# Altium schematic sheet LEDcontroller.SchDoc
size A3; Author: MAKinteract; Revision: 1; SheetNumber: 2; SheetTotal: 3
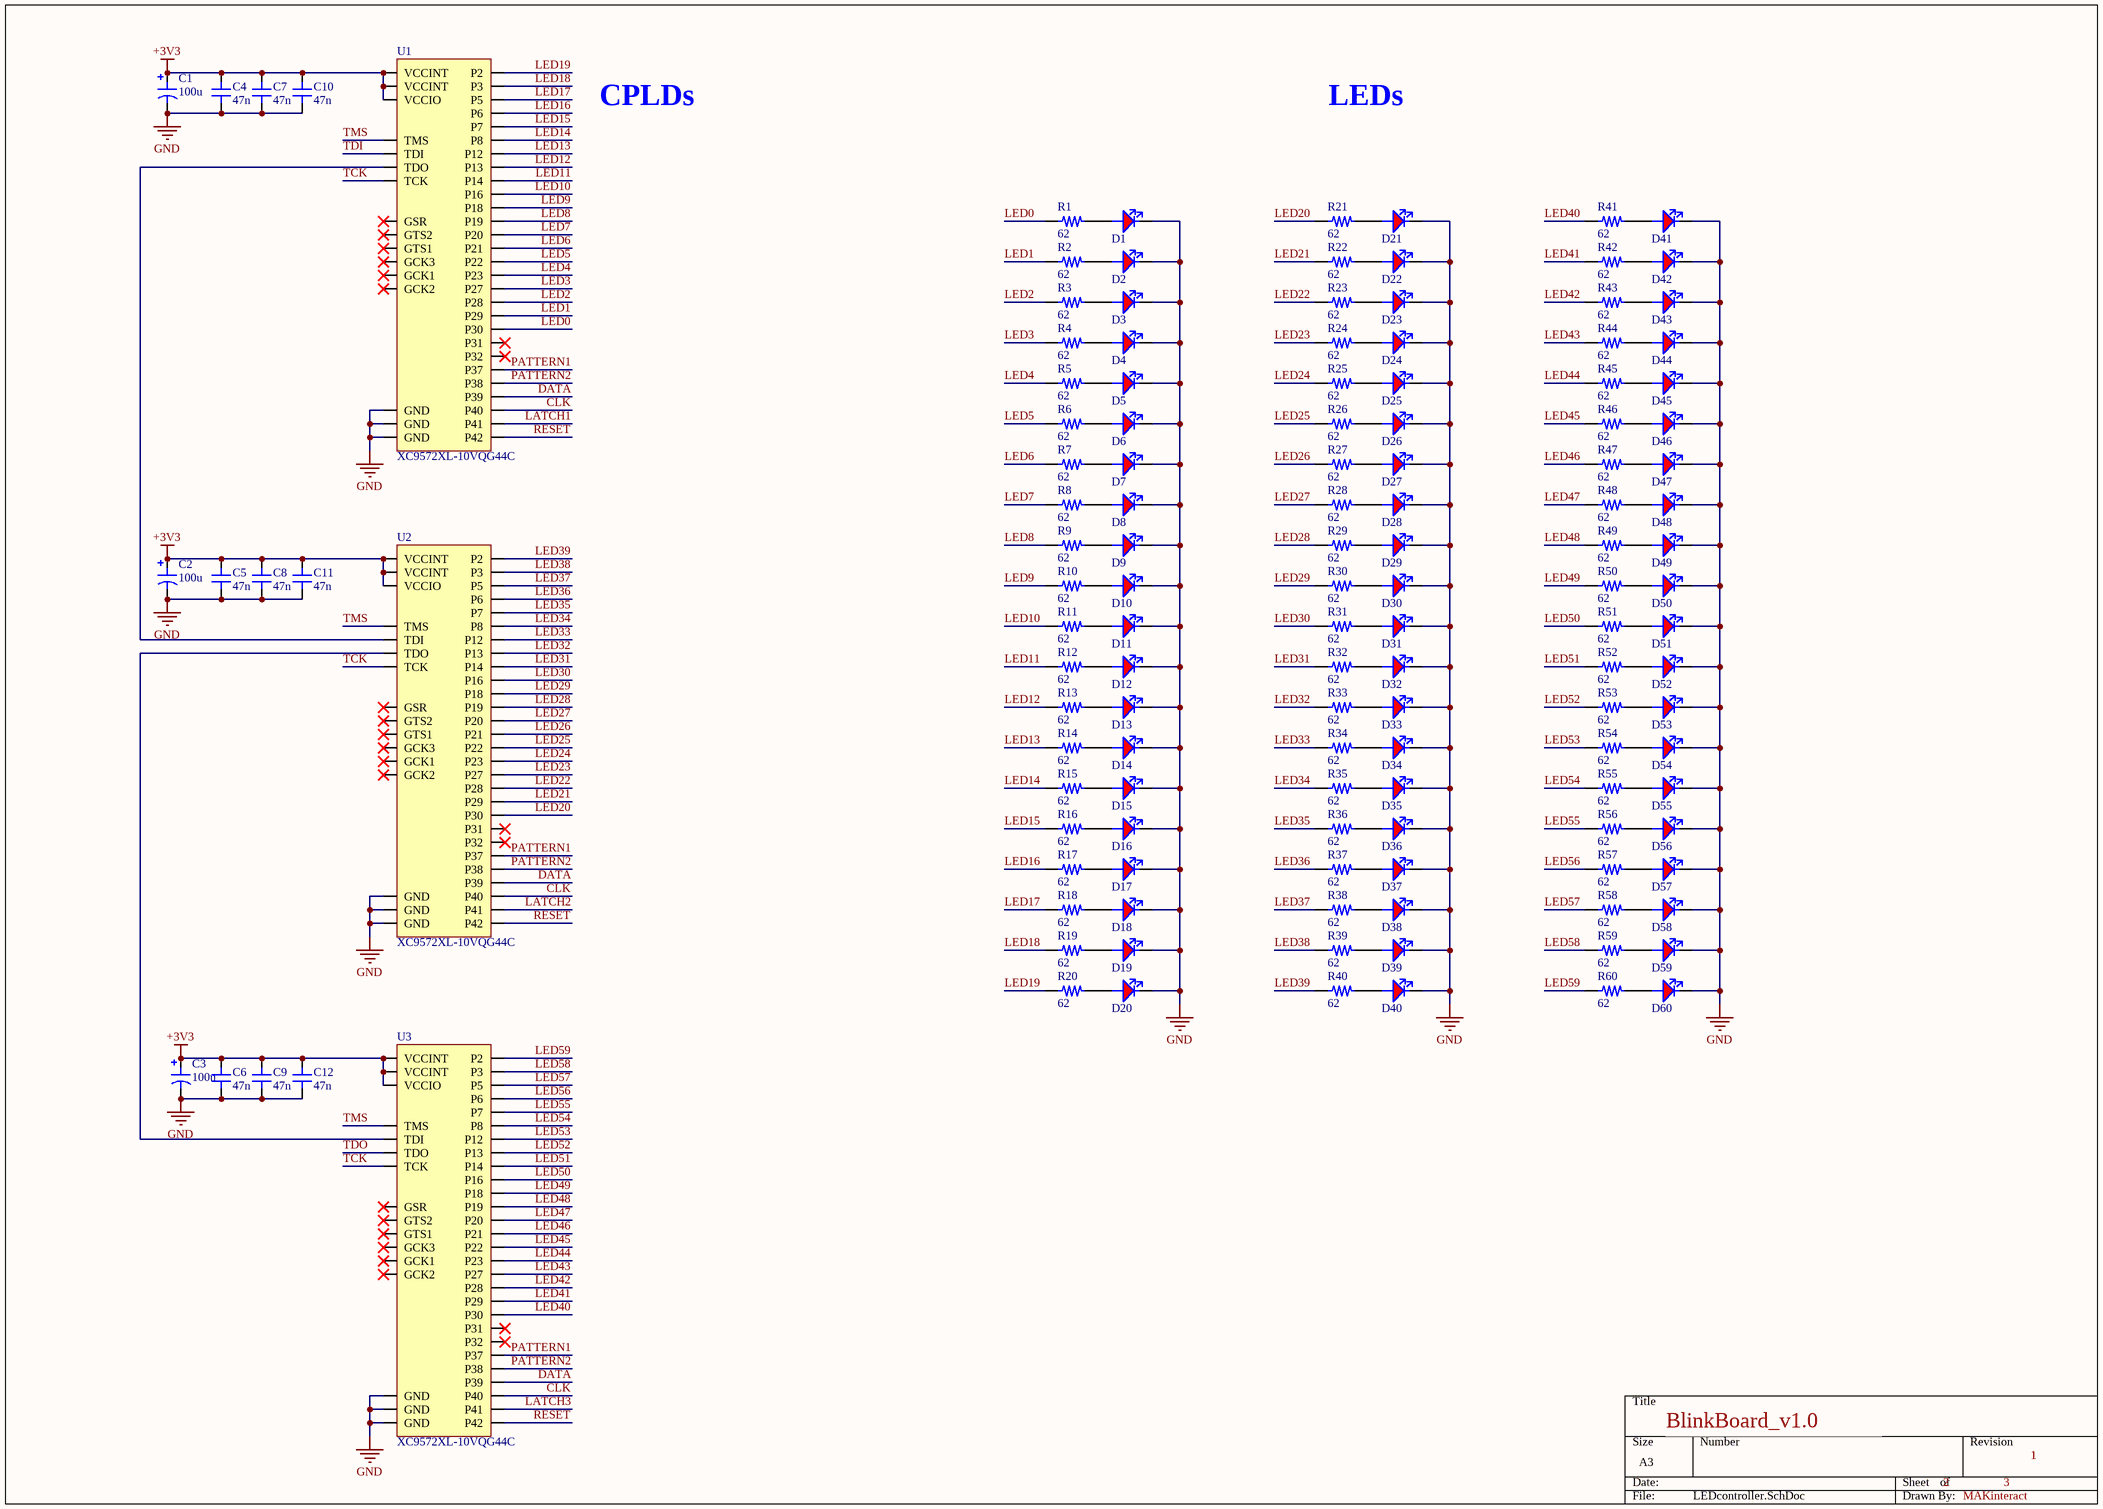
[diagram p0: LEDcontroller.SchDoc]

## Parts
C1  100u  [C1206]
C2  100u  [C1206]
C3  100u  [C1206]
C4  47n  [C0805]
C5  47n  [C0805]
C6  47n  [C0805]
C7  47n  [C0805]
C8  47n  [C0805]
C9  47n  [C0805]
C10  47n  [C0805]
C11  47n  [C0805]
C12  47n  [C0805]
D1  LED0402_RED  [LED0402]  (value not drawn)
D2  LED0402_RED  [LED0402]  (value not drawn)
D3  LED0402_RED  [LED0402]  (value not drawn)
D4  LED0402_RED  [LED0402]  (value not drawn)
D5  LED0402_RED  [LED0402]  (value not drawn)
D6  LED0402_RED  [LED0402]  (value not drawn)
D7  LED0402_RED  [LED0402]  (value not drawn)
D8  LED0402_RED  [LED0402]  (value not drawn)
D9  LED0402_RED  [LED0402]  (value not drawn)
D10  LED0402_RED  [LED0402]  (value not drawn)
D11  LED0402_RED  [LED0402]  (value not drawn)
D12  LED0402_RED  [LED0402]  (value not drawn)
D13  LED0402_RED  [LED0402]  (value not drawn)
D14  LED0402_RED  [LED0402]  (value not drawn)
D15  LED0402_RED  [LED0402]  (value not drawn)
D16  LED0402_RED  [LED0402]  (value not drawn)
D17  LED0402_RED  [LED0402]  (value not drawn)
D18  LED0402_RED  [LED0402]  (value not drawn)
D19  LED0402_RED  [LED0402]  (value not drawn)
D20  LED0402_RED  [LED0402]  (value not drawn)
D21  LED0402_RED  [LED0402]  (value not drawn)
D22  LED0402_RED  [LED0402]  (value not drawn)
D23  LED0402_RED  [LED0402]  (value not drawn)
D24  LED0402_RED  [LED0402]  (value not drawn)
D25  LED0402_RED  [LED0402]  (value not drawn)
D26  LED0402_RED  [LED0402]  (value not drawn)
D27  LED0402_RED  [LED0402]  (value not drawn)
D28  LED0402_RED  [LED0402]  (value not drawn)
D29  LED0402_RED  [LED0402]  (value not drawn)
D30  LED0402_RED  [LED0402]  (value not drawn)
D31  LED0402_RED  [LED0402]  (value not drawn)
D32  LED0402_RED  [LED0402]  (value not drawn)
D33  LED0402_RED  [LED0402]  (value not drawn)
D34  LED0402_RED  [LED0402]  (value not drawn)
D35  LED0402_RED  [LED0402]  (value not drawn)
D36  LED0402_RED  [LED0402]  (value not drawn)
D37  LED0402_RED  [LED0402]  (value not drawn)
D38  LED0402_RED  [LED0402]  (value not drawn)
D39  LED0402_RED  [LED0402]  (value not drawn)
D40  LED0402_RED  [LED0402]  (value not drawn)
D41  LED0402_RED  [LED0402]  (value not drawn)
D42  LED0402_RED  [LED0402]  (value not drawn)
D43  LED0402_RED  [LED0402]  (value not drawn)
D44  LED0402_RED  [LED0402]  (value not drawn)
D45  LED0402_RED  [LED0402]  (value not drawn)
D46  LED0402_RED  [LED0402]  (value not drawn)
D47  LED0402_RED  [LED0402]  (value not drawn)
D48  LED0402_RED  [LED0402]  (value not drawn)
D49  LED0402_RED  [LED0402]  (value not drawn)
D50  LED0402_RED  [LED0402]  (value not drawn)
D51  LED0402_RED  [LED0402]  (value not drawn)
D52  LED0402_RED  [LED0402]  (value not drawn)
D53  LED0402_RED  [LED0402]  (value not drawn)
D54  LED0402_RED  [LED0402]  (value not drawn)
D55  LED0402_RED  [LED0402]  (value not drawn)
D56  LED0402_RED  [LED0402]  (value not drawn)
D57  LED0402_RED  [LED0402]  (value not drawn)
D58  LED0402_RED  [LED0402]  (value not drawn)
D59  LED0402_RED  [LED0402]  (value not drawn)
D60  LED0402_RED  [LED0402]  (value not drawn)
R1  62  [RES0402]
R2  62  [RES0402]
R3  62  [RES0402]
R4  62  [RES0402]
R5  62  [RES0402]
R6  62  [RES0402]
R7  62  [RES0402]
R8  62  [RES0402]
R9  62  [RES0402]
R10  62  [RES0402]
R11  62  [RES0402]
R12  62  [RES0402]
R13  62  [RES0402]
R14  62  [RES0402]
R15  62  [RES0402]
R16  62  [RES0402]
R17  62  [RES0402]
R18  62  [RES0402]
R19  62  [RES0402]
R20  62  [RES0402]
R21  62  [RES0402]
R22  62  [RES0402]
R23  62  [RES0402]
R24  62  [RES0402]
R25  62  [RES0402]
R26  62  [RES0402]
R27  62  [RES0402]
R28  62  [RES0402]
R29  62  [RES0402]
R30  62  [RES0402]
R31  62  [RES0402]
R32  62  [RES0402]
R33  62  [RES0402]
R34  62  [RES0402]
R35  62  [RES0402]
R36  62  [RES0402]
R37  62  [RES0402]
R38  62  [RES0402]
R39  62  [RES0402]
R40  62  [RES0402]
R41  62  [RES0402]
R42  62  [RES0402]
R43  62  [RES0402]
R44  62  [RES0402]
R45  62  [RES0402]
R46  62  [RES0402]
R47  62  [RES0402]
R48  62  [RES0402]
R49  62  [RES0402]
R50  62  [RES0402]
R51  62  [RES0402]
R52  62  [RES0402]
R53  62  [RES0402]
R54  62  [RES0402]
R55  62  [RES0402]
R56  62  [RES0402]
R57  62  [RES0402]
R58  62  [RES0402]
R59  62  [RES0402]
R60  62  [RES0402]
U1  XC9572XL-10VQG44C  [VQFP44]
U2  XC9572XL-10VQG44C  [VQFP44]
U3  XC9572XL-10VQG44C  [VQFP44]

## Nets
+3V3: C1.2 C2.2 C3.2 C4.2 C5.2 C6.2 C7.2 C8.2 C9.2 C10.2 C11.2 C12.2 U1.15(VCCINT) U1.26(VCCIO) U1.35(VCCINT) U2.15(VCCINT) U2.26(VCCIO) U2.35(VCCINT) U3.15(VCCINT) U3.26(VCCIO) U3.35(VCCINT)
GND: C1.1 C2.1 C3.1 C4.1 C5.1 C6.1 C7.1 C8.1 C9.1 C10.1 C11.1 C12.1 D1.2(K) D2.2(K) D3.2(K) D4.2(K) D5.2(K) D6.2(K) D7.2(K) D8.2(K) D9.2(K) D10.2(K) D11.2(K) D12.2(K) D13.2(K) D14.2(K) D15.2(K) D16.2(K) D17.2(K) D18.2(K) D19.2(K) D20.2(K) D21.2(K) D22.2(K) D23.2(K) D24.2(K) D25.2(K) D26.2(K) D27.2(K) D28.2(K) D29.2(K) D30.2(K) D31.2(K) D32.2(K) D33.2(K) D34.2(K) D35.2(K) D36.2(K) D37.2(K) D38.2(K) D39.2(K) D40.2(K) D41.2(K) D42.2(K) D43.2(K) D44.2(K) D45.2(K) D46.2(K) D47.2(K) D48.2(K) D49.2(K) D50.2(K) D51.2(K) D52.2(K) D53.2(K) D54.2(K) D55.2(K) D56.2(K) D57.2(K) D58.2(K) D59.2(K) D60.2(K) U1.4(GND) U1.17(GND) U1.25(GND) U2.4(GND) U2.17(GND) U2.25(GND) U3.4(GND) U3.17(GND) U3.25(GND)
CLK: U1.40(P40) U2.40(P40) U3.40(P40)
DATA: U1.39(P39) U2.39(P39) U3.39(P39)
LATCH1: U1.41(P41)
LATCH2: U2.41(P41)
LATCH3: U3.41(P41)
LED0: R1.1 U1.30(P30)
LED1: R2.1 U1.29(P29)
LED2: R3.1 U1.28(P28)
LED3: R4.1 U1.27(P27)
LED4: R5.1 U1.23(P23)
LED5: R6.1 U1.22(P22)
LED6: R7.1 U1.21(P21)
LED7: R8.1 U1.20(P20)
LED8: R9.1 U1.19(P19)
LED9: R10.1 U1.18(P18)
LED10: R11.1 U1.16(P16)
LED11: R12.1 U1.14(P14)
LED12: R13.1 U1.13(P13)
LED13: R14.1 U1.12(P12)
LED14: R15.1 U1.8(P8)
LED15: R16.1 U1.7(P7)
LED16: R17.1 U1.6(P6)
LED17: R18.1 U1.5(P5)
LED18: R19.1 U1.3(P3)
LED19: R20.1 U1.2(P2)
LED20: R21.1 U2.30(P30)
LED21: R22.1 U2.29(P29)
LED22: R23.1 U2.28(P28)
LED23: R24.1 U2.27(P27)
LED24: R25.1 U2.23(P23)
LED25: R26.1 U2.22(P22)
LED26: R27.1 U2.21(P21)
LED27: R28.1 U2.20(P20)
LED28: R29.1 U2.19(P19)
LED29: R30.1 U2.18(P18)
LED30: R31.1 U2.16(P16)
LED31: R32.1 U2.14(P14)
LED32: R33.1 U2.13(P13)
LED33: R34.1 U2.12(P12)
LED34: R35.1 U2.8(P8)
LED35: R36.1 U2.7(P7)
LED36: R37.1 U2.6(P6)
LED37: R38.1 U2.5(P5)
LED38: R39.1 U2.3(P3)
LED39: R40.1 U2.2(P2)
LED40: R41.1 U3.30(P30)
LED41: R42.1 U3.29(P29)
LED42: R43.1 U3.28(P28)
LED43: R44.1 U3.27(P27)
LED44: R45.1 U3.23(P23)
LED45: R46.1 U3.22(P22)
LED46: R47.1 U3.21(P21)
LED47: R48.1 U3.20(P20)
LED48: R49.1 U3.19(P19)
LED49: R50.1 U3.18(P18)
LED50: R51.1 U3.16(P16)
LED51: R52.1 U3.14(P14)
LED52: R53.1 U3.13(P13)
LED53: R54.1 U3.12(P12)
LED54: R55.1 U3.8(P8)
LED55: R56.1 U3.7(P7)
LED56: R57.1 U3.6(P6)
LED57: R58.1 U3.5(P5)
LED58: R59.1 U3.3(P3)
LED59: R60.1 U3.2(P2)
PATTERN1: U1.37(P37) U2.37(P37) U3.37(P37)
PATTERN2: U1.38(P38) U2.38(P38) U3.38(P38)
RESET: U1.42(P42) U2.42(P42) U3.42(P42)
TCK: U1.11(TCK) U2.11(TCK) U3.11(TCK)
TDI: U1.9(TDI)
TDO: U3.24(TDO)
TMS: U1.10(TMS) U2.10(TMS) U3.10(TMS)
NetD1_1: D1.1(A) R1.2
NetD2_1: D2.1(A) R2.2
NetD3_1: D3.1(A) R3.2
NetD4_1: D4.1(A) R4.2
NetD5_1: D5.1(A) R5.2
NetD6_1: D6.1(A) R6.2
NetD7_1: D7.1(A) R7.2
NetD8_1: D8.1(A) R8.2
NetD9_1: D9.1(A) R9.2
NetD10_1: D10.1(A) R10.2
NetD11_1: D11.1(A) R11.2
NetD12_1: D12.1(A) R12.2
NetD13_1: D13.1(A) R13.2
NetD14_1: D14.1(A) R14.2
NetD15_1: D15.1(A) R15.2
NetD16_1: D16.1(A) R16.2
NetD17_1: D17.1(A) R17.2
NetD18_1: D18.1(A) R18.2
NetD19_1: D19.1(A) R19.2
NetD20_1: D20.1(A) R20.2
NetD21_1: D21.1(A) R21.2
NetD22_1: D22.1(A) R22.2
NetD23_1: D23.1(A) R23.2
NetD24_1: D24.1(A) R24.2
NetD25_1: D25.1(A) R25.2
NetD26_1: D26.1(A) R26.2
NetD27_1: D27.1(A) R27.2
NetD28_1: D28.1(A) R28.2
NetD29_1: D29.1(A) R29.2
NetD30_1: D30.1(A) R30.2
NetD31_1: D31.1(A) R31.2
NetD32_1: D32.1(A) R32.2
NetD33_1: D33.1(A) R33.2
NetD34_1: D34.1(A) R34.2
NetD35_1: D35.1(A) R35.2
NetD36_1: D36.1(A) R36.2
NetD37_1: D37.1(A) R37.2
NetD38_1: D38.1(A) R38.2
NetD39_1: D39.1(A) R39.2
NetD40_1: D40.1(A) R40.2
NetD41_1: D41.1(A) R41.2
NetD42_1: D42.1(A) R42.2
NetD43_1: D43.1(A) R43.2
NetD44_1: D44.1(A) R44.2
NetD45_1: D45.1(A) R45.2
NetD46_1: D46.1(A) R46.2
NetD47_1: D47.1(A) R47.2
NetD48_1: D48.1(A) R48.2
NetD49_1: D49.1(A) R49.2
NetD50_1: D50.1(A) R50.2
NetD51_1: D51.1(A) R51.2
NetD52_1: D52.1(A) R52.2
NetD53_1: D53.1(A) R53.2
NetD54_1: D54.1(A) R54.2
NetD55_1: D55.1(A) R55.2
NetD56_1: D56.1(A) R56.2
NetD57_1: D57.1(A) R57.2
NetD58_1: D58.1(A) R58.2
NetD59_1: D59.1(A) R59.2
NetD60_1: D60.1(A) R60.2
NetU1_24: U1.24(TDO) U2.9(TDI)
NetU2_24: U2.24(TDO) U3.9(TDI)

Not connected (* = marked no-connect by the designer): U1 1(GCK3)* 31(P31)* 32(P32)* 33(GSR)* 34(GTS2)* 36(GTS1)* 43(GCK1)* 44(GCK2)*; U2 1(GCK3)* 31(P31)* 32(P32)* 33(GSR)* 34(GTS2)* 36(GTS1)* 43(GCK1)* 44(GCK2)*; U3 1(GCK3)* 31(P31)* 32(P32)* 33(GSR)* 34(GTS2)* 36(GTS1)* 43(GCK1)* 44(GCK2)*

## Notes on the sheet
- CPLDs
- LEDs
- BlinkBoard_v1.0

## Library data of the parts
C1-C3 = C1206_100u: 100uF Solid MnO2 Tantalum Capacitor,  4 V +/-20%,  T491 Series; Manufacturer: KEMET; Manufacturer Part Number: T491A107M004AT; Tolerance: 20%; ESR (Equivalent Series Resistance): 4R; Voltage Rating: 4V; Leakage Current: 4uA; Dissipation Factor: 30%; Polarity: Polar; Life (Hours): 2000Hour; Supplier 1: Digi-Key; Stock 1: 52740; RoHS: Yes; Mount: Surface Mount,PCB; Case/Package: 1206; Dielectric Material: Tantalum; Case Code (Imperial): 1206; Case Code (Metric): 3216; Min Operating Temperature: -55°C; Max Operating Temperature: 125°C; Capacitance: 100uF; Packaging: Tape and Reel; Package Quantity: 1; Termination: SMD/SMT; Voltage: 4V; Voltage Rating (DC): 4V; Features: General Purpose; Length: 3.2mm; Height: 1.6mm; Width: 1.6mm; Height - Seated (Max): 0.071inch; Lead Pitch: 1.2mm; Depth: 1.6mm; Radiation Hardening: No; REACH SVHC: No SVHC; Lead Free: Lead Free; ComponentLink1URL: https://datasheet.ciiva.com/14103/t491serie-eng-tds-14103975.pdf?src-supplier=Distrelec; ComponentLink1Description: https://datasheet.ciiva.com/14103/t491serie-eng-tds-14103975.pdf?src-supplier=Distrelec; ComponentLink2URL: https://datasheet.ciiva.com/7851/1854511-7851162.pdf?src-supplier=Element14; ComponentLink2Description: https://datasheet.ciiva.com/7851/1854511-7851162.pdf?src-supplier=Element14; ComponentLink3URL: https://datasheet.ciiva.com/14589/70095774-14589211.pdf?src-supplier=Allied+Electronics; ComponentLink3Description: https://datasheet.ciiva.com/14589/70095774-14589211.pdf?src-supplier=Allied+Electronics; ComponentLink4URL: https://datasheet.ciiva.com/258/kem-t2005-t491-258169.pdf?src-supplier=Digi-Key; ComponentLink4Description: https://datasheet.ciiva.com/258/kem-t2005-t491-258169.pdf?src-supplier=Digi-Key; ComponentLink5URL: https://datasheet.ciiva.com/258/kem-t2005-t491-258170.pdf?src-supplier=Digi-Key; ComponentLink5Description: https://datasheet.ciiva.com/258/kem-t2005-t491-258170.pdf?src-supplier=Digi-Key; ComponentLink6URL: https://datasheet.ciiva.com/258/kem-t2005-t491-258171.pdf?src-supplier=Digi-Key; ComponentLink6Description: https://datasheet.ciiva.com/258/kem-t2005-t491-258171.pdf?src-supplier=Digi-Key; ComponentLink7URL: https://datasheet.ciiva.com/46417/1854511-46417596.pdf?src-supplier=Element14; ComponentLink7Description: https://datasheet.ciiva.com/46417/1854511-46417596.pdf?src-supplier=Element14; ComponentLink8URL: https://datasheet.ciiva.com/14606/70095774-14606061.pdf?src-supplier=Allied+Electronics; ComponentLink8Description: https://datasheet.ciiva.com/14606/70095774-14606061.pdf?src-supplier=Allied+Electronics; Supplier Part Number 1: 399-3688-6-ND; Pricing 1: 1 = 0.67000, 10 = 0.47100, 50 = 0.35640, 100 = 0.31040, 500 = 0.22990, 1000 = 0.19542 (USD)
C4-C12 = C0805_47n: Cap Ceramic 0.047uF 50V X7R 5% SMD 0805 125C Paper T/R; Manufacturer: Yageo; Manufacturer Part Number: CC0805JRX7R9BB473; Capacitance: 47nF; Supplier 1: Digi-Key; Stock 1: 8317; RoHS: Yes; Mount: Surface Mount; Case/Package: 0805; Weight: 0.000194oz; Case Code (Imperial): 0805; Case Code (Metric): 2012; Min Operating Temperature: -55°C; Max Operating Temperature: 125°C; Tolerance: 5%; Voltage Rating: 50V; Voltage Rating (DC): 50V; Packaging: Tape and Reel; Dielectric: X7R; Termination: SMD/SMT; Composition: Ceramic; Length: 2mm; Height: 0.85mm; Width: 1.25mm; Thickness: 0.037inch; Depth: 1.25mm; Radiation Hardening: No; Lead Free: Lead Free; Halogen Free: Halogen Free; ComponentLink4URL: https://datasheet.ciiva.com/11587/upy-gphc-x7r-6-3v-to-50v-8-11587207.pdf?src-supplier=Avnet; ComponentLink4Description: https://datasheet.ciiva.com/11587/upy-gphc-x7r-6-3v-to-50v-8-11587207.pdf?src-supplier=Avnet; Supplier Part Number 1: 311-3553-6-ND; Pricing 1: 1 = 0.21000, 10 = 0.14700, 100 = 0.06900, 500 = 0.04838, 1000 = 0.04005 (USD)
D1-D60 = LED0402_RED: Led red; Manufacturer: Everlight; Manufacturer Part Number: EAST1005BA0; Color: Blue; Lens Color: Colorless; Lens Transparency: Clear; Luminous Intensity: 50mcd; Test Current: 5mA; Viewing Angle: 120°; Dominant Wavelength: 471nm; Forward Voltage: 3.3V; Number of LEDs: 1; Forward Current: 30mA; Power Rating: 75mW; Wavelength: 631nm; Lens Style: Rectangular,Square; RoHS: Yes; Mount: Surface Mount; Case/Package: 0402; Packaging: Tape and Reel; Length: 1mm; Height: 0.45mm; Width: 0.5mm; Supplier 1: Digi-Key; Stock 1: 50832; Number of Pins: 2; Case Code (Imperial): 0402; Case Code (Metric): 1005; Min Operating Temperature: -30°C; Max Operating Temperature: 85°C; Package Quantity: 1; Illumination Color: Red; Radiation Hardening: No; Lead Free: Lead Free; REACH SVHC: Unknown; ComponentLink3URL: https://datasheet.ciiva.com/13945/vlmo1500-13945367.pdf?src-supplier=Digi-Key; ComponentLink3Description: https://datasheet.ciiva.com/13945/vlmo1500-13945367.pdf?src-supplier=Digi-Key; Supplier Part Number 1: VLMS1500-GS08DKR-ND; Pricing 1: 1 = 0.48000, 10 = 0.34600, 100 = 0.15360, 500 = 0.10752, 1000 = 0.08832 (USD)
R1-R60 = R0402_62: RES SMD 62 OHM 1% 1/16W 0402; Manufacturer: Yageo; Manufacturer Part Number: RC0402FR-0762RL; Resistance: 62R; Temperature Coefficient: 100ppm/°C; Voltage Rating (DC): 50V; Power Rating: 63mW; Supplier 1: Digi-Key; Stock 1: 193361; RoHS: Yes; Case/Package: 0402; Case Code (Imperial): 0402; Case Code (Metric): 1005; Min Operating Temperature: -55°C; Max Operating Temperature: 155°C; Packaging: Tape and Reel; Tolerance: 1%; Composition: Thick Film; Voltage Rating: 50V; Termination: SMD/SMT; Military Standard: Not; Length: 1mm; Height: 0.35mm; Width: 0.5mm; Depth: 0.5mm; REACH SVHC: Unknown; Lead Free: Lead Free; ComponentLink1URL: https://datasheet.ciiva.com/17086/pyu-rc0402-51-rohs-l-6-r-17086553.pdf?src-supplier=Future+Electronics; ComponentLink1Description: https://datasheet.ciiva.com/17086/pyu-rc0402-51-rohs-l-6-r-17086553.pdf?src-supplier=Future+Electronics; Supplier Part Number 1: 311-62.0LRDKR-ND; Pricing 1: 1 = 0.10000, 10 = 0.01600, 100 = 0.00640, 1000 = 0.00289, 2500 = 0.00251, 5000 = 0.00207 (USD)
U1-U3 = XC9572XL: XILINX - XC9572XL-10VQG44C. - CPLD, 72 MACROCELL, 3.3V, 44VQFP; Propagation Delay: 10ns; Speed Grade: 10; Min Supply Voltage: 3V; Max Supply Voltage: 3.6V; Frequency: 178MHz; Number of Gates: 1600; Number of Logic Blocks (LABs): 4; Number of Macrocells: 72; Number of I/Os: 34; Memory Type: FLASH; Max Frequency: 100MHz; Resistance: 62R; Tolerance: 1%; Temperature Coefficient: 100ppm/°C; Voltage Rating (DC): 50V; Power Rating: 63mW; Supplier 1: Digi-Key; Manufacturer: Xilinx; Manufacturer Part Number: XC9572XL-10VQG44C; Stock 1: 4319; RoHS: Yes; Mount: Surface Mount; Case/Package: TQFP; Number of Pins: 44; Min Operating Temperature: 0°C; Max Operating Temperature: 70°C; Packaging: Tray; Operating Supply Voltage: 3.3V; Package Quantity: 160; Number of Logic Elements/Cells: 4; Termination: SMD/SMT; Turn-On Delay Time: 10ns; Radiation Hardening: No; REACH SVHC: No SVHC; Lead Free: Lead Free; Supplier Part Number 1: 122-1448-ND; Pricing 1: 1 = 3.71000 (USD); Case Code (Imperial): 0402; Case Code (Metric): 1005; Composition: Thick Film; Voltage Rating: 50V; Military Standard: Not; Length: 1mm; Height: 0.35mm; Width: 0.5mm; Depth: 0.5mm; ComponentLink1Description: https://www.xilinx.com/support/documentation/data_sheets/ds057.pdf; ComponentLink1URL: https://www.xilinx.com/support/documentation/data_sheets/ds057.pdf; ComponentLink2Description: https://www.xilinx.com/support/documentation/package_specs/vq44.pdf; ComponentLink2URL: https://www.xilinx.com/support/documentation/package_specs/vq44.pdf